# Altium schematic sheet SBH_Charger_Main.SchDoc: SBH_Charger_Main
size C; Date: 01/15/2023; Author: Electric Squad; Organization: ORGANIZATION; Address1: ADDRESS 1; Address2: ADDRESS 2; Address3: ADDRESS 3; Address4: ADDRESS 4; Revision: -; SheetNumber: 2; SheetTotal: 5; ENG_APP_DATE: --/--/--; DSN_APP_DATE: --/--/--; CHK_APP_DATE: --/--/--
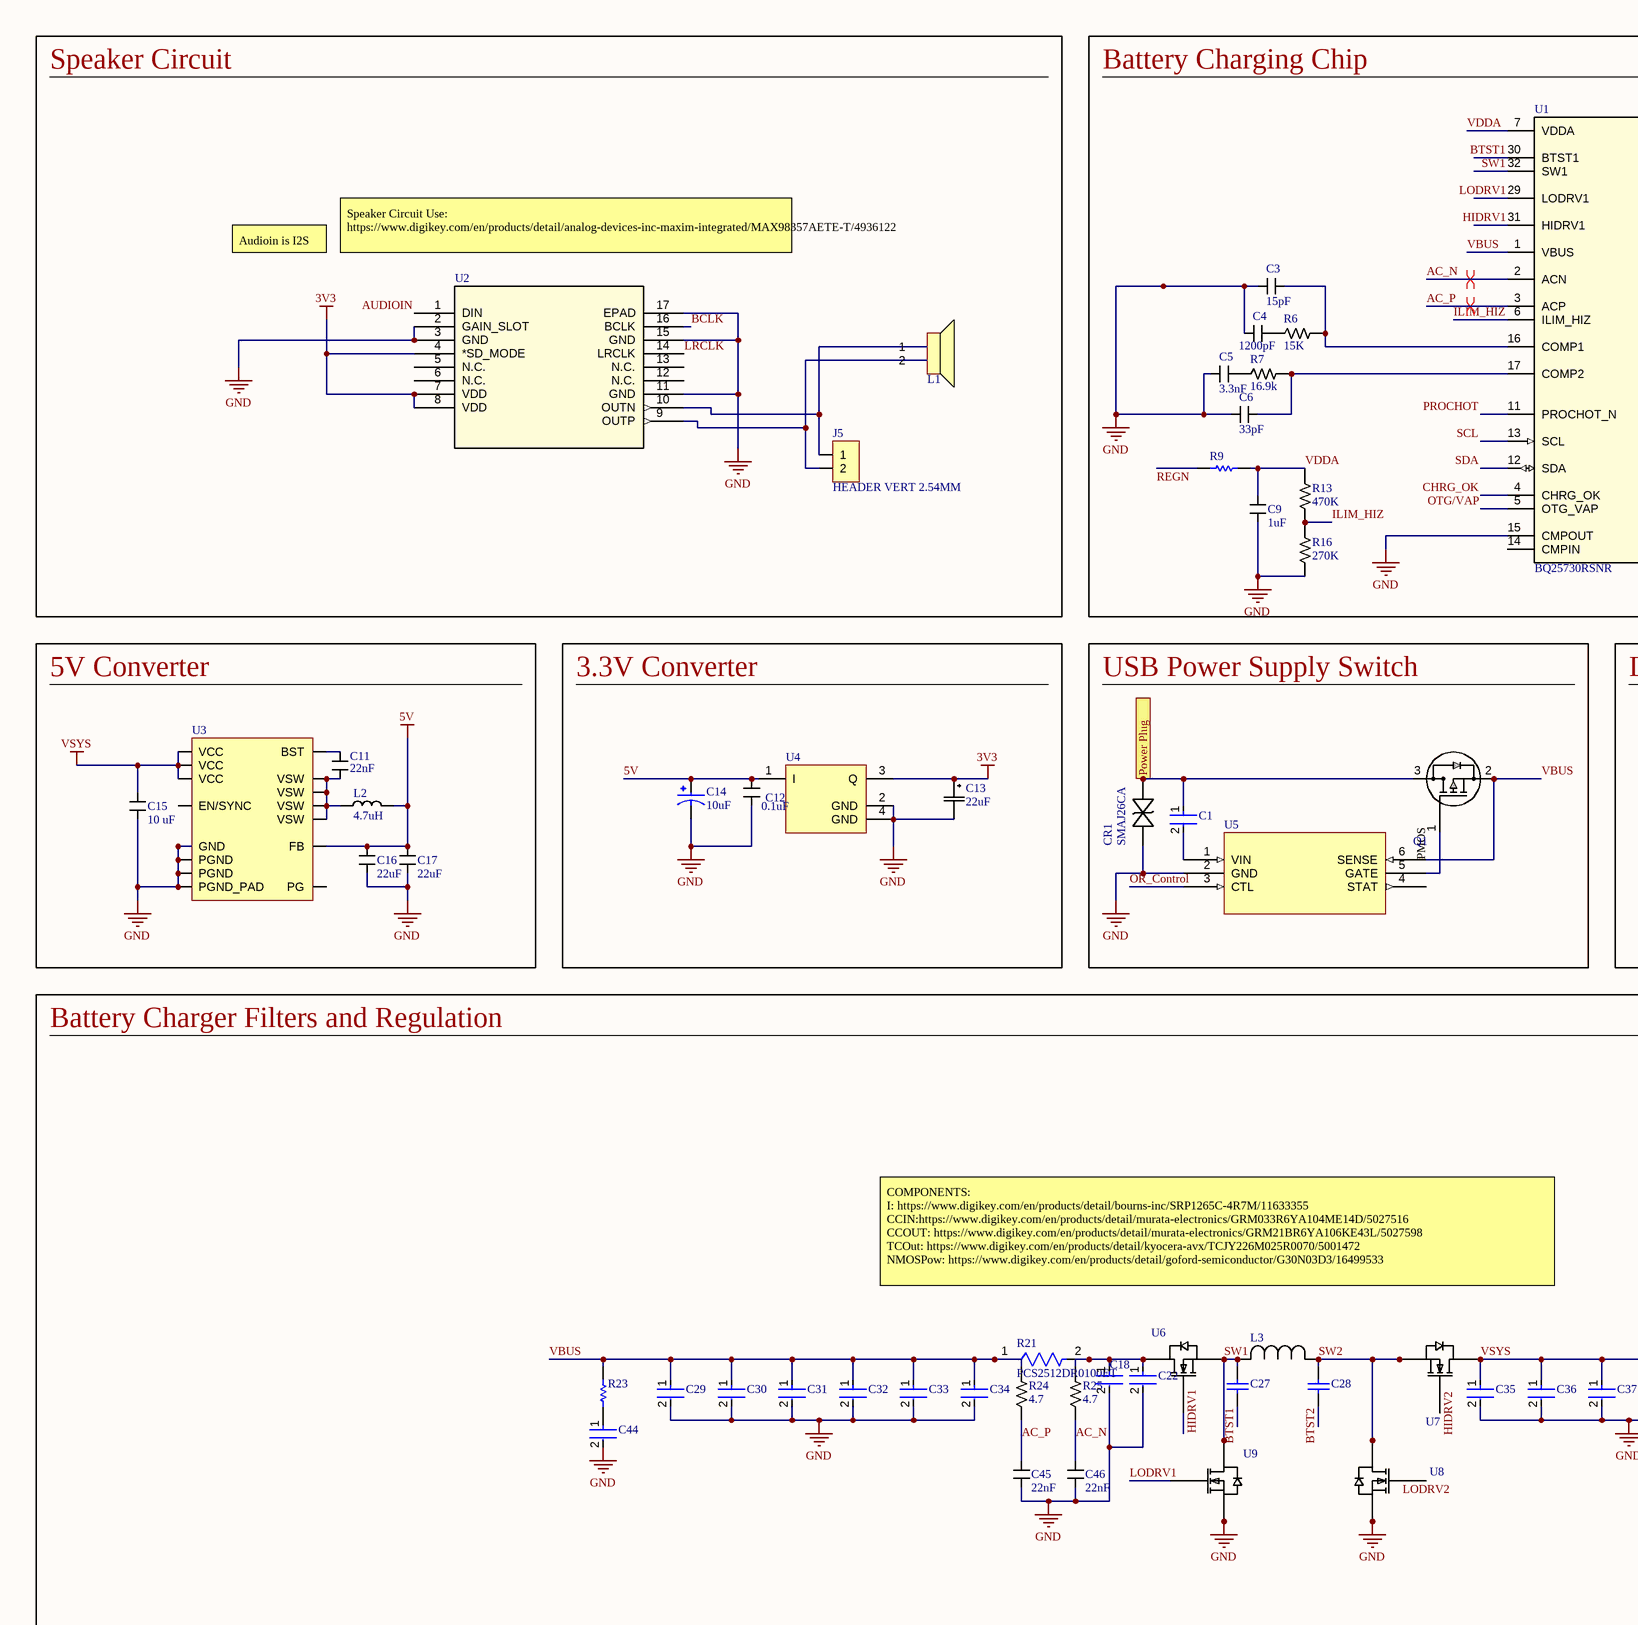
[diagram p0: SBH_Charger_Main.SchDoc, left]
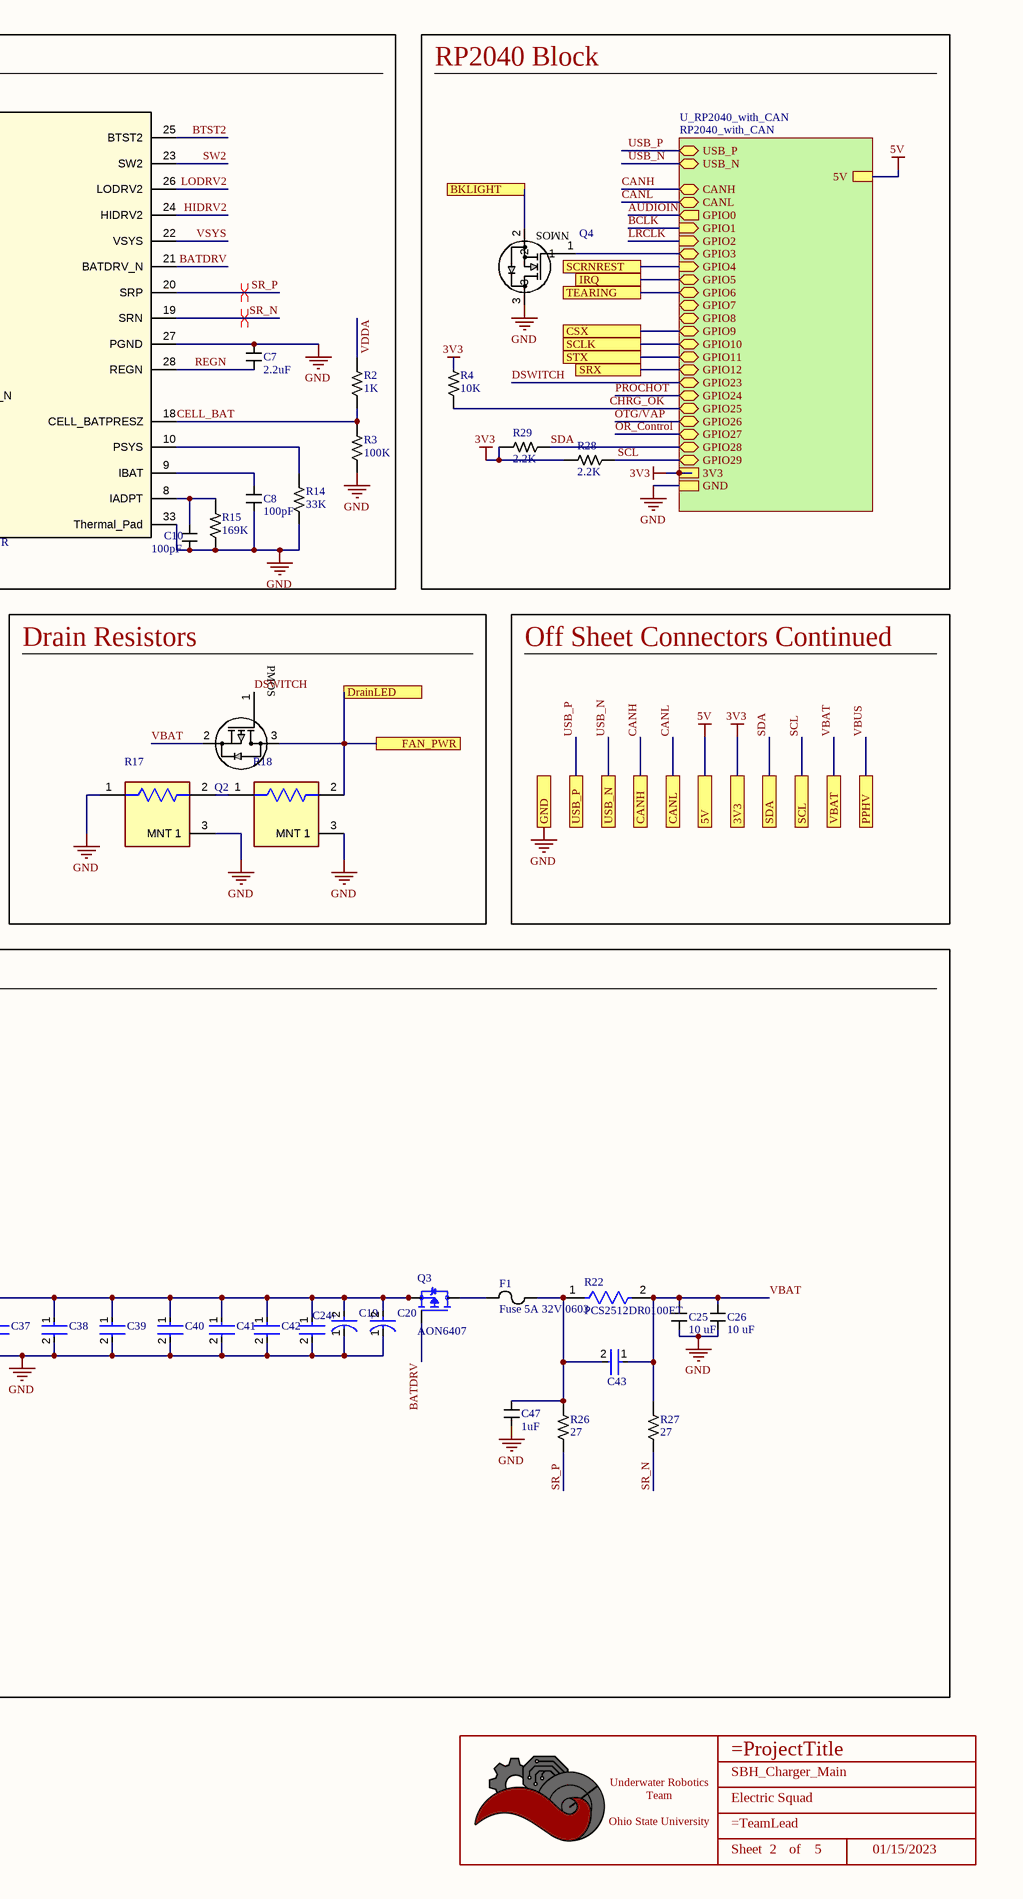
[diagram p1: SBH_Charger_Main.SchDoc, right]

## Parts
*  Title_Block  [LOGO]  (value not drawn)  (graphical)
C1  CC0402KRX7R9BB103  [CAPACITOR_0402]  (value not drawn)
C3  value 15pF  [CAPACITOR_0402]  (hidden comment: 15pF Ceramic 50V)
C4  value 1200pF  [CAPACITOR_0402]  (hidden comment: 1200pF Ceramic 50V)
C5  value 3.3nF  [CAPACITOR_0402]  (hidden comment: 3.3nF Ceramic 50V)
C6  value 33pF  [CAPACITOR_0402]  (hidden comment: 33pF Ceramic 50V)
C7  value 2.2uF  [CAPACITOR_0402]  (hidden comment: 2.2uF Ceramic 35V)
C8  value 100pF  [CAPACITOR_0603]  (hidden comment: 100pF Ceramic 50V)
C9  value 1uF  [CAPACITOR_0603]  (hidden comment: 1uF Ceramic 16V)
C10  value 100pF  [CAPACITOR_0603]  (hidden comment: 100pF Ceramic 50V)
C11  value 22nF  [CAPACITOR_0402]  (hidden comment: 22nF Ceramic 25V)
C12  value 0.1uF  [CAPACITOR_0603]  (hidden comment: 100nF Ceramic 25V)
C13  value 22uF  [PCAP_8x5.4-ELECT_NCA]  (hidden comment: 22uF electrolytic 35 V)
C14  value 10uF  [CAP_EEHZC1J100P]  (hidden comment: 10uF electrolytic 63V)
C15  Value (uF): 10 uF  [CAPACITOR_1206]  (hidden comment: 10uF Ceramic 25V)
C16  value 22uF  [CAPACITOR_0805]  (hidden comment: 22uF Ceramic 10V)
C17  value 22uF  [CAPACITOR_0805]  (hidden comment: 22uF Ceramic 10V)
C18  CC0402KRX7R9BB103  [FP-CC0402-MFG]  (value not drawn)
C19  TAJD226K035RNJ  [FP-TAJD-MFG]  (value not drawn)
C20  TAJD226K035RNJ  [FP-TAJD-MFG]  (value not drawn)
C22  C0402C102J5GACTU  [FP-C0402-BB-MFG]  (value not drawn)
C24  C3216X7R1V106M160AC  [FP-C3216-160-0_2-IPC_C]  (value not drawn)
C25  Value (uF): 10 uF  [CAPACITOR_1206]  (hidden comment: 10uF Ceramic 25V)
C26  Value (uF): 10 uF  [CAPACITOR_1206]  (hidden comment: 10uF Ceramic 25V)
C27  GRM188R71H473KA61D  [CAPC1608X90X35ML10T15]  (value not drawn)
C28  GRM188R71H473KA61D  [CAPC1608X90X35ML10T15]  (value not drawn)
C29  C3216X7R1V106M160AC  [FP-C3216-160-0_2-IPC_C]  (value not drawn)
C30  C3216X7R1V106M160AC  [FP-C3216-160-0_2-IPC_C]  (value not drawn)
C31  C3216X7R1V106M160AC  [FP-C3216-160-0_2-IPC_C]  (value not drawn)
C32  C3216X7R1V106M160AC  [FP-C3216-160-0_2-IPC_C]  (value not drawn)
C33  C3216X7R1V106M160AC  [FP-C3216-160-0_2-IPC_C]  (value not drawn)
C34  C3216X7R1V106M160AC  [FP-C3216-160-0_2-IPC_C]  (value not drawn)
C35  C3216X7R1V106M160AC  [FP-C3216-160-0_2-IPC_C]  (value not drawn)
C36  C3216X7R1V106M160AC  [FP-C3216-160-0_2-IPC_C]  (value not drawn)
C37  C3216X7R1V106M160AC  [FP-C3216-160-0_2-IPC_C]  (value not drawn)
C38  C3216X7R1V106M160AC  [FP-C3216-160-0_2-IPC_C]  (value not drawn)
C39  C3216X7R1V106M160AC  [FP-C3216-160-0_2-IPC_C]  (value not drawn)
C40  C3216X7R1V106M160AC  [FP-C3216-160-0_2-IPC_C]  (value not drawn)
C41  C3216X7R1V106M160AC  [FP-C3216-160-0_2-IPC_C]  (value not drawn)
C42  C3216X7R1V106M160AC  [FP-C3216-160-0_2-IPC_C]  (value not drawn)
C43  GRM033R6YA104ME14D  [FP-GRM033-0_03-IPC_C]  (value not drawn)
C44  UMK107AB7105KA-T  [FP-0603-L_1_6_0_15-W_0_8-IPC_C]  (value not drawn)
C45  value 22nF  [CAPACITOR_0402]  (hidden comment: 22nF Ceramic 25V)
C46  value 22nF  [CAPACITOR_0402]  (hidden comment: 22nF Ceramic 25V)
C47  value 1uF  [CAPACITOR_0603]  (hidden comment: 1uF Ceramic 16V)
CR1  SMAJ26CA  [SMASeries_LTF]
F1  Fuse 5A 32V 0603  [2-SMD Fuse 0603]
J5  HEADER VERT 2.54MM  [HEADER_2PIN_2.54MM]
L1  SPEAKER_SP_1609S  [SPEAKER_SP-1609S]  (value not drawn)
L2  value 4.7uH  [INDUCTOR_SLF7045]  (hidden comment: 4.7uH Shielded Drum Core)
L3  SRP1770TA-3R3M  [INDUCTOR_SRP1770TA-3R3M_BRN]  (value not drawn)
Q1  DMP3056L-7  [SOT-23-3]  (value not drawn)
Q2  DMP3056L-7  [SOT-23-3]  (value not drawn)
Q3  AON6407  [TRANS_AON6407]
Q4  MOSFET N-CH 30V 5.8A SOT-23-3  [SOT-23-3]  (value not drawn)
R2  Value  (Ohms): 1K  [RESISTOR_0603]  (hidden comment: 1k Ohm 5% 1/8W)
R3  Value  (Ohms): 100K  [RESISTOR_0603]  (hidden comment: 100k Ohm 5% 1/8W)
R4  Value  (Ohms): 10K  [RESISTOR_0603]  (hidden comment: 10k Ohm 5% 1/10W)
R6  Value  (Ohms): 15K  [RESISTOR_0603]  (hidden comment: 15k Ohm 5% 1/10W)
R7  Value  (Ohms): 16.9k  [RESISTOR_0402]  (hidden comment: 16.9k Ohm 1% 1/16W)
R9  CRCW040210R0FKEDHP  [RESC1005X40X25NL05T10]  (value not drawn)
R13  Value  (Ohms): 470K  [RESISTOR_0603]  (hidden comment: 470k Ohm 5% 1/10W)
R14  Value  (Ohms): 33K  [RESISTOR_0805]  (hidden comment: 33k Ohm 5% 1/8W)
R15  Value  (Ohms): 169K  [RESISTOR_0603]  (hidden comment: 169K OHM 1% 1/3W)
R16  Value  (Ohms): 270K  [RESISTOR_0603]  (hidden comment: 270k Ohm 1% 1/10W)
R17  PWR163S-25-10R0JE  [FP-PWR163-MFG]  (value not drawn)
R18  PWR163S-25-10R0JE  [FP-PWR163-MFG]  (value not drawn)
R21  PCS2512DR0100ET  [FP-PCS2512-MFG]
R22  PCS2512DR0100ET  [FP-PCS2512-MFG]
R23  CRCW06032R20FKEA  [RESC1609X50X30ML10T20]  (value not drawn)
R24  Value  (Ohms): 4.7  [RESISTOR_0603]  (hidden comment: 4.7 Ohm 5% 1/8W)
R25  Value  (Ohms): 4.7  [RESISTOR_0603]  (hidden comment: 4.7 Ohm 5% 1/8W)
R26  Value  (Ohms): 27  [RESISTOR_0603]  (hidden comment: 27 Ohm 5% 1/8W)
R27  Value  (Ohms): 27  [RESISTOR_0603]  (hidden comment: 27 Ohm 5% 1/8W)
R28  Value  (Ohms): 2.2K  [RESISTOR_0402]  (hidden comment: 2.2k Ohm 1% 1/16W)
R29  Value  (Ohms): 2.2K  [RESISTOR_0402]  (hidden comment: 2.2k Ohm 1% 1/16W)
U1  BQ25730RSNR  [RSN0032B-IPC_B]
U2  MAX98357AETE+T  [TQFN-16]  (value not drawn)
U3  REG BUCK 5V 1A  [QFN-16 (3x3)]  (value not drawn)
U4  TLE42744GS V33  [INF-PG-SOT223_SC-73_N]  (value not drawn)
U5  LTC4412ES6TRPBF  [TSOT-23_S6]  (value not drawn)
U6  G30N03D3  [DNH0008A_NV]  (value not drawn)
U7  G30N03D3  [DNH0008A_NV]  (value not drawn)
U8  G30N03D3  [DNH0008A_NV]  (value not drawn)
U9  G30N03D3  [DNH0008A_NV]  (value not drawn)

## Blocks framed on the sheet
Speaker Circuit: J5 L1 U2
Battery Charging Chip: C3-C10 R2 R3 R6 R7 R9 R13-R16 U1
RP2040 Block: Q4 R4 R28 R29
5V Converter: C11 C15-C17 L2 U3
3.3V Converter: C12-C14 U4
USB Power Supply Switch: C1 CR1 Q1 U5
Drain Resistors: Q2 R17 R18
Battery Charger Filters and Regulation: C18-C20 C22 C24-C47 F1 L3 Q3 R21-R27 U6-U9

## Sub-sheets
U_RP2040_with_CAN = RP2040_with_CAN: USB_P (bidir), USB_N (bidir), 5V, CANH (bidir), CANL (bidir), GPIO0 (out), GPIO1 (in), GPIO2 (in), GPIO3 (bidir), GPIO4 (in), GPIO5 (bidir), GPIO6 (bidir), GPIO7 (bidir), GPIO8 (bidir), GPIO9 (bidir), GPIO10 (bidir), GPIO11 (bidir), GPIO12 (bidir), GPIO23 (bidir), GPIO24 (bidir), GPIO25 (bidir), GPIO26 (bidir), GPIO27 (bidir), GPIO28 (bidir), GPIO29 (bidir), 3V3, GND

## Ports
3V3, 5V, BKLIGHT, CANH, CANL, CSX, DrainLED, FAN_PWR, GND, IRQ, Power Plug, PPHV, SCL, SCLK, SCRNREST, SDA, SRX, STX, TEARING, USB_N, USB_P, VBAT

## Nets
3V3: C13.1 R4.1 R28.1 R29.1 U2.4(*SD_MODE) U2.7(VDD) U2.8(VDD) U4.3(Q) ; port 3V3, sheet U_RP2040_with_CAN/3V3
5V: C12.1 C14.1 C16.1 C17.1 L2.1 U3.5(FB) U4.1(I) ; port 5V, sheet U_RP2040_with_CAN/5V
GND: C3.2 C4.2 C5.2 C6.2 C7.1 C8.2 C9.2 C10.2 C12.2 C13.2 C14.2 C15.2 C16.2 C17.2 C18.2 C19.1(C) C20.1(C) C22.2 C24.2 C25.2 C26.2 C29.2 C30.2 C31.2 C32.2 C33.2 C34.2 C35.2 C36.2 C37.2 C38.2 C39.2 C40.2 C41.2 C42.2 C44.2 C45.2 C46.2 C47.1 CR1.2 Q4.3 R3.2 R14.2 R15.2 R16.2 R17.1 R17.3(MNT_1) R18.3(MNT_1) U1.15(CMPOUT) U1.27(PGND) U1.33(Thermal_Pad) U2.2(GAIN_SLOT) U2.3(GND) U2.11(GND) U2.15(GND) U2.17(EPAD) U3.4(GND) U3.14(PGND) U3.15(PGND) U3.17(PGND_PAD) U4.2(GND) U4.4(GND) U5.2(GND) U8.1(S) U8.2(S) U8.3(S) U9.1(S) U9.2(S) U9.3(S) ; port GND, sheet U_RP2040_with_CAN/GND
VSYS: C15.1 C19.2(A) C20.2(A) C24.1 C35.1 C36.1 C37.1 C38.1 C39.1 C40.1 C41.1 C42.1 Q3.1(S) Q3.2(S) Q3.3(S) U1.22(VSYS) U3.2(VCC) U3.3(VCC) U3.11(VCC) U7.5(D) U7.6(D) U7.7(D) U7.8(D) U7.9(D)
AC_N: C46.1 R25.2 U1.2(ACN)
AC_P: C45.1 R24.2 U1.3(ACP)
AUDIOIN: U2.1(DIN) ; sheet U_RP2040_with_CAN/GPIO0
BATDRV: Q3.4(G) U1.21(BATDRV_N)
BCLK: U2.16(BCLK) ; sheet U_RP2040_with_CAN/GPIO1
BKLIGHT: Q4.2 ; port BKLIGHT
BTST1: C27.1 U1.30(BTST1)
BTST2: C28.1 U1.25(BTST2)
CANH: port CANH, sheet U_RP2040_with_CAN/CANH
CANL: port CANL, sheet U_RP2040_with_CAN/CANL
CELL_BAT: R2.2 R3.1 U1.18(CELL_BATPRESZ)
CHRG_OK: R4.2 U1.4(CHRG_OK) ; sheet U_RP2040_with_CAN/GPIO25
CSX: port CSX, sheet U_RP2040_with_CAN/GPIO9
DrainLED: Q2.3 R18.2 ; port FAN_PWR, port DrainLED
DSWITCH: Q2.1 ; sheet U_RP2040_with_CAN/GPIO23
HIDRV1: U1.31(HIDRV1) U6.4(G)
HIDRV2: U1.24(HIDRV2) U7.4(G)
ILIM_HIZ: R13.2 R16.1 U1.6(ILIM_HIZ)
IRQ: port IRQ, sheet U_RP2040_with_CAN/GPIO5
LODRV1: U1.29(LODRV1) U9.4(G)
LODRV2: U1.26(LODRV2) U8.4(G)
LRCLK: U2.14(LRCLK) ; sheet U_RP2040_with_CAN/GPIO2
OR_Control: U5.3(CTL) ; sheet U_RP2040_with_CAN/GPIO27
OTG/VAP: U1.5(OTG_VAP) ; sheet U_RP2040_with_CAN/GPIO26
Power Plug: C1.1 CR1.1 Q1.3 ; port Power Plug
PROCHOT: U1.11(PROCHOT_N) ; sheet U_RP2040_with_CAN/GPIO24
REGN: C7.2 R9.1 U1.28(REGN)
SCL: R28.2 U1.13(SCL) ; port SCL, sheet U_RP2040_with_CAN/GPIO29
SCLK: port SCLK, sheet U_RP2040_with_CAN/GPIO10
SCRNREST: port SCRNREST, sheet U_RP2040_with_CAN/GPIO4
SDA: R29.2 U1.12(SDA) ; port SDA, sheet U_RP2040_with_CAN/GPIO28
SR_N: R27.2 U1.19(SRN)
SR_P: R26.2 U1.20(SRP)
SRX: port SRX, sheet U_RP2040_with_CAN/GPIO12
STX: port STX, sheet U_RP2040_with_CAN/GPIO11
SW1: C27.2 L3.2 U1.32(SW1) U6.1(S) U6.2(S) U6.3(S) U9.5(D) U9.6(D) U9.7(D) U9.8(D) U9.9(D)
SW2: C28.2 L3.1 U1.23(SW2) U7.1(S) U7.2(S) U7.3(S) U8.5(D) U8.6(D) U8.7(D) U8.8(D) U8.9(D)
TEARING: port TEARING, sheet U_RP2040_with_CAN/GPIO6
USB_N: port USB_N, sheet U_RP2040_with_CAN/USB_N
USB_P: port USB_P, sheet U_RP2040_with_CAN/USB_P
VBAT: C25.1 C26.1 C43.1 Q2.2 R22.2 R27.1 ; port VBAT
VBUS: C29.1 C30.1 C31.1 C32.1 C33.1 C34.1 Q1.2 R21.1 R23.2 R24.1 U1.1(VBUS) U5.6(SENSE) ; port PPHV
VDDA: C9.1 R2.1 R9.2 R13.1 U1.7(VDDA)
NetC1_2: C1.2 U5.1(VIN)
NetC3_1: C3.1 R6.1 U1.16(COMP1)
NetC4_1: C4.1 R6.2
NetC5_1: C5.1 R7.2
NetC6_1: C6.1 R7.1 U1.17(COMP2)
NetC8_1: C8.1 U1.9(IBAT)
NetC10_1: C10.1 R15.1 U1.8(IADPT)
NetC11_1: C11.1 U3.10(BST)
NetC11_2: C11.2 L2.2 U3.1(VSW) U3.12(VSW) U3.13(VSW) U3.16(VSW)
NetC18_1: C18.1 C22.1 R21.2 R25.1 U6.5(D) U6.6(D) U6.7(D) U6.8(D) U6.9(D)
NetC43_2: C43.2 C47.2 F1.2 R22.1 R26.1
NetC44_1: C44.1 R23.1
NetF1_1: F1.1 Q3.5_8(D)
NetJ5_1: J5.1 L1.1 U2.10(OUTN)
NetJ5_2: J5.2 L1.2 U2.9(OUTP)
NetQ1_1: Q1.1 U5.5(GATE)
NetQ4_1: Q4.1 ; sheet U_RP2040_with_CAN/GPIO3
NetR14_1: R14.1 U1.10(PSYS)
NetR17_2: R17.2 R18.1

Not connected (* = marked no-connect by the designer): U1 14(CMPIN); U2 5(N.C.) 6(N.C.) 12(N.C.) 13(N.C.); U3 8(PG) 9(EN/SYNC); U5 4(STAT)

## Layout directives
differential pair: AC_N, AC_P, SR_N, SR_P

## Notes on the sheet
- Audioin is I2S
- Speaker Circuit Use: https://www.digikey.com/en/products/detail/analog-devices-inc-maxim-integrated/MAX98357AETE-T/4936122
- Off Sheet Connectors Continued
- COMPONENTS:
  I: https://www.digikey.com/en/products/detail/bourns-inc/SRP1265C-4R7M/11633355
  CCIN:https://www.digikey.com/en/products/detail/murata-electronics/GRM033R6YA104ME14D/5027516
  CCOUT: https://www.digikey.com/en/products/detail/murata-electronics/GRM21BR6YA106KE43L/5027598
  TCOut: https://www.digikey.com/en/products/detail/kyocera-avx/TCJY226M025R0070/5001472
  NMOSPow: https://www.digikey.com/en/products/detail/goford-semiconductor/G30N03D3/16499533
- DWG. NO.
- REV.
- SHT.
- THIS DOCUMENT AND THE DATA DISCLOSED HEREIN OR HEREWITH IS THE PROPERTY OF ALTIUM LIMITED AND MAY BE FREELY DISTRIBUTED IN WHOLE. NO RIGHTS ARE RESERVED OR EXPRESS OR IMPLIED WARANTEE GIVEN.
- REVISION
- DESCRIPTION
- DATE
- APPROVED
- ENG:
- APPROVALS
- PROJECT
- DSN:
- CHK:
- REFERENCE DOCUMENTS
- PROJECT REVISION:
- TITLE
- DOCUMENT REVISION:
- DESIGN ITEM:
- BOM:
- FAB DWG:
- PCB DWG:
- ASSY DWG:
- SCALE:
- SIZE
- B
- CAGE CODE
- FILE NAME
- DWG NO.
- SHEET
- OF
- REV
- (in symbol AO3404A) NMOS
- (in symbol CMP-04424-000506-1) +
- (in symbol DMP3056L-7) PMOS
- (in symbol Title_Block) Underwater Robotics Team / Ohio State University; Sheet; of

## Library data of the parts
* = Title_Block: UWRT Schematic Title Block Template / Created June 2021, Dylan Trainor
C1 = CAP CER 0.01 UF 0402: CAP CER 10000PF 50V X7R 0402; Manufacturer: YAGEO; Temperature Coefficient: 30ppm/°C; Capacitance: 10 nF; Material: Ceramic; Automotive Grade: NA; Tolerance: 0.1; Value: 10 nF; Device Class L3: Ceramic Capacitors; Temperature: -55°C to +125°C; Footprint Url: http://www.yageo.com/exep/pages/download/literatures/UPY-C_GEN_24.pdf; Ipc Land Pattern Name: CAPC10050X50; Device Class L1: Passive Components; Automotive: No; Octopart: https://octopart.com/cc0402krx7r9bb103-yageo-8376513; Manufacturer Part Number: CC0402KRX7R9BB103; Lead Free: Yes; Temperature Range Low: -55°C; Height: 0.55mm; ComponentLink2URL: http://www.yageo.com/documents/recent/UPY-GP_NP0_16V-to-50V_16.pdf; Category: Cap; ComponentLink2Description: Datasheet; Temperature Range High: +125°C; Digikey Description: CAP CER 10000PF 50V X7R 0402; Voltage Rating: 50 V; Package: CC0402; Device Class L2: Capacitors; Mouser Description: 0402 10 nF 50 V ±10 % Tolerance X7R SMT Multilayer Ceramic Capacitor; RoHS: TRUE; Temperature Characteristic: X7R; Supplier 1: Future Electronics; Supplier Part Number 1: 8570871
C3 = CAPACITOR_0.000015uF_0402: CAP CER 15PF 50V C0G/NP0 0402; Tolerance: +/- 5%; Made By: Robert Pafford; Voltage: 50V; Supplier 1: Newark; Supplier Part Number 1: 82AC9245
C4 = CAPACITOR_0.0012uF_0402: CAP CER 1200PF 50V X7R 0402; Tolerance: +/- 5%; Made By: Robert Pafford; Voltage: 50V; Supplier 1: Future Electronics; Supplier Part Number 1: 5334081
C5 = CAPACITOR_0.0033uF_0402: CAP CER 3300PF 50V X7R 0402; Tolerance: +/- 5%; Made By: Robert Pafford; Voltage: 50V; Supplier 1: Arrow Electronics; Supplier Part Number 1: CL05B332KB5NNNC
C6 = CAPACITOR_0.000033uF_0402: CAP CER 33PF 50V C0G/NP0 0402; Tolerance: +/- 5%; Made By: Robert Pafford; Voltage: 50V; Supplier 1: Newark; Supplier Part Number 1: 82AC9259
C7 = CAPACITOR_2.2uF_0402: Cap 2.2uF 35V +/-10% / Ceramic 0402; Made By: Flip B; Tolerance: +/- 10%; Voltage: 35V; Supplier 1: Digi-Key; Supplier Part Number 1: 445-9028-1-ND
C8 C10 = CAPACITOR_0.0001uF_0603: CAP CER 100PF 50V C0G/NP0 0603; Tolerance: +/- 5%; Made By: Robert Pafford; Voltage: 50V; Supplier 1: Arrow Electronics; Supplier Part Number 1: CL10C101JB8NNNC
C9 C47 = CAPACITOR_1uF_0603: Cap 1uF 16V +/-10% / Ceramic 0603; Made By: Flip B; Tolerance: +/- 10%; Voltage: 16V; Supplier 1: Arrow Electronics; Supplier Part Number 1: C1608X7R1C105K080AC
C11 C45 C46 = CAPACITOR_0.022uF_0402: Cap 22nF 25V +/-10% / Ceramic 0402; Made By: Robert Pafford; Tolerance: +/- 10%; Voltage: 25V; Supplier 1: Digi-Key; Supplier Part Number 1: 445-1261-1-ND
C12 = CAPACITOR_0.1uF_0603_25V: Cap 100nF 25V +/-10% / Ceramic 0603; Voltage: 6.3V; Made By: Flip B; ComponentLink1Description: Datsheet; ComponentLink1URL: https://www.mouser.com/datasheet/2/212/KEM_C1002_X7R_SMD-1102033.pdf; Tolerance: +/- 10%; Supplier 1: Digikey; Supplier Part Number 1: 1276-1006-1-ND
C13 = CAP ALUM 22UF 20% 35V SMD: 22 µF 35 V Aluminum Electrolytic Capacitors Radial, Can - SMD 1000 Hrs; Made by: Robert Pafford; Voltage: 35V; Supplier 1: Digi-Key; Supplier Part Number 1: PCE3952DKR-ND
C14 = CAP ALUM 10UF 20% 63V SMD: 10 µF 63 V Aluminum - Polymer Capacitors Radial, Can SMD 120mOhm; Made by: Robert Pafford; Tolerance: +/- 20%; Max Voltage: 63V; Supplier 1: Digi-Key; Supplier Part Number 1: P15466CT-ND
C15 C25 C26 = CAPACITOR_10uF_1206: Cap 10uF 25V +/-10% / Ceramic 1206; Made By: Robert Pafford; Tolerance: +/- 10%; Voltage: 25V; Supplier 1: Digi-Key; Supplier Part Number 1: 1276-1804-6-ND
C16 C17 = CAPACITOR_22uF_0805: Cap 22uF 10V +/-20% X5R / Ceramic 0805; Made By: Robert Pafford; Tolerance: +/- 20%; Voltage: 10V; Supplier 1: Digi-Key; Supplier Part Number 1: 445-7665-6-ND
C18 = CMP-2100-03592-2: CAP CER 10000PF 50V X7R 0402; Manufacturer: YAGEO; Temperature Coefficient: 30ppm/°C; Capacitance: 10 nF; Material: Ceramic; Automotive Grade: NA; Tolerance: 0.1; Value: 10 nF; Device Class L3: Ceramic Capacitors; Temperature: -55°C to +125°C; Footprint Url: http://www.yageo.com/exep/pages/download/literatures/UPY-C_GEN_24.pdf; Ipc Land Pattern Name: CAPC10050X50; Device Class L1: Passive Components; Automotive: No; Octopart: https://octopart.com/cc0402krx7r9bb103-yageo-8376513; Manufacturer Part Number: CC0402KRX7R9BB103; Lead Free: Yes; Temperature Range Low: -55°C; Height: 0.55mm; ComponentLink2URL: http://www.yageo.com/documents/recent/UPY-GP_NP0_16V-to-50V_16.pdf; Category: Cap; ComponentLink2Description: Datasheet; Temperature Range High: +125°C; Digikey Description: CAP CER 10000PF 50V X7R 0402; Voltage Rating: 50 V; Package: CC0402; Device Class L2: Capacitors; Mouser Description: 0402 10 nF 50 V ±10 % Tolerance X7R SMT Multilayer Ceramic Capacitor; RoHS: TRUE; Temperature Characteristic: X7R
C19 C20 = CMP-04424-000506-1: 22uF 35V  ±10% 900mΩ 2917  SMD Tantalum Capacitor; ESR (Equivalent Series Resistance): 900mR; Dissipation Factor: 6%; Polarity: Polar; Leakage Current: 7.7uA; Min Operating Temperature: -55°C; Dielectric Material: Tantalum; Radiation Hardening: No; Height: 2.9mm; Voltage Rating: 35V; Features: General Purpose; Package Quantity: 1; Capacitance: 22uF; Tolerance: 10%; Series: TAJ; Height - Seated (Max): 0.122inch; Mount: Surface Mount; Termination: SMD/SMT; Length: 7.3mm; Construction: Flat; Width: 4.3mm; Case Code (Metric): 7343; Voltage: 35V; Depth: 4.3mm; Packaging: Tape and Reel; Max Operating Temperature: 125°C; RoHS Compliant: Yes; Case/Package: 2917; Lead Free: Lead Free; Case Code (Imperial): 2917; Number of Pins: 2; REACH SVHC: No SVHC; Voltage Rating (DC): 35V
C22 = CMP-2008-03295-2: CAP CER 1000PF 50V 5% NP0 0402; Manufacturer: Kemet; Material: Ceramic; Temperature Characteristic: C0G; Temperature Coefficient: 15%; Capacitance: 1,000 pF; Tolerance: 0.05; Value: 1,000 pF; Manufacturer Part Number: C0402C102J5GACTU; ComponentLink2Description: Datasheet; Octopart: https://octopart.com/c0402c102j5gactu-kemet-9145103; Package: C0402-BB; Ipc Land Pattern Name: CAPC10050X50; Automotive: No; Mouser Description: Cap Ceramic 0.001uF 50V C0G 5% SMD 0402 125°C Paper T/R; Digikey Description: CAP CER 1000PF 50V 5% NP0 0402; Temperature Range High: +125°C; Temperature Range Low: -55°C; Device Class L3: Ceramic Capacitors; Temperature: -55°C to +125°C; Device Class L1: Passive Components; Category: Cap; Voltage Rating: 50 V; Device Class L2: Capacitors; ComponentLink2URL: https://content.kemet.com/datasheets/KEM_C1002_X7R_SMD.pdf; Height: 0.55mm; RoHS: TRUE; Lead Free: Yes
C24 C29-C42 = CMP-2000-06048-2: Multilayer Ceramic Capacitors 10uF ±20% 35V X7R SMD 1206; RoHS Compliant: Yes; Voltage Rating (DC): 35V; Termination: SMD/SMT; Thickness: 0.071inch; Max Operating Temperature: 125°C; Length: 3.2mm; Width: 0.063inch; Tolerance: 20%; Case Code (Metric): 3216; Capacitance: 10uF; REACH SVHC: No SVHC; Case/Package: 1206; Dielectric: X7R; Series: C; Min Operating Temperature: -55°C; Resistor Type: Ceramic; Weight: 0.000571oz; Voltage Rating: 35V; Mount: Surface Mount; Package Quantity: 2000; Case Code (Imperial): 1206; Depth: 1.6mm; Packaging: Tape and Reel; Dielectric Material: Ceramic; Lead Free: Lead Free; Height: 1.6mm; Construction: Flat
C27 C28 = CMP-2006-02927-1: Manufacturer: Murata; Part Number: GRM188R71H473KA61D
C43 = CAPACITOR_0.1uF_0603_1: Chip Multilayer Ceramic Capacitors for General Purpose, 0201, 0.10uF, X5R, 15%, 20%, 35V; Capacitance: 100nF; Tolerance: 20%; Supplier 1: Arrow Electronics; Supplier Part Number 1: GRM033R6YA104ME14D; Case/Package: 0201; Mount: Surface Mount; Voltage Rating (DC): 35V; Weight: 1.2E-05oz; Case Code (Metric): 0603; Min Operating Temperature: -55°C; Thickness: 0.013inch; Case Code (Imperial): 0201; Dielectric: X5R; Termination: SMD/SMT; Length: 0.024inch; Height: 0.3mm; Package Quantity: 15000; Width: 0.012inch; Voltage Rating: 35V; Max Operating Temperature: 85°C; Packaging: Tape and Reel
C44 = CMP-2000-07531-4: Ceramic Capacitor General Use 1uF ±10% 50V X7R 0603; Series: M; Width: 0.031inch; Mount: Surface Mount; Radiation Hardening: No; Voltage Rating (DC): 50V; Packaging: Tape and Reel; Termination: SMD/SMT; Depth: 0.8mm; Case Code (Metric): 1608; Case Code (Imperial): 0603; Height: 0.8mm; Voltage Rating: 50V; Package Quantity: 1; Halogen Free: Halogen Free; Dielectric: X7R; Min Operating Temperature: -55°C; Length: 1.6mm; Construction: Flat; Tolerance: 10%; Thickness: 0.037inch; Max Operating Temperature: 125°C; Case/Package: 0603; Capacitance: 1uF; RoHS Compliant: Yes
CR1 = TVS_SMAJ26CA: TVS DIODE 26VWM 42.1VC DO214AC; Mfr_Name: Littelfuse Inc; Type: DEV; Copyright: Copyright (C) 2024 Ultra Librarian. All rights reserved.; Manufacturer_Part_Number: SMAJ26CA; RefDes: RefDes
F1 = ERB-RE5R00V: Pansonic | 32V | 5A | 0603 | Fast Blow; Mfr_Name: Panasonic; Breaking Capacity: 150A; Manufacturer_Part_Number: ERB-RE5R00V; Current Rating: 5A; Voltage Rating: 32V; Response Time: Fast Blow; Package: 1206; Created By: Robert Pafford; Supplier 1: Digi-Key; Supplier Part Number 1: P15125CT-ND
J5 = HEADER_2PIN_2.54MM: CONN HEADER VERT 2POS 2.54MM; Configuration: Vertical; Current Per Pin: 1A; Number of Positions: 2; Manufacturer: *; Pitch: 2.54mm; Color: Natural; Created By: Robert P; ComponentLink1Description: Datasheet; ComponentLink1URL: https://www.molex.com/pdm_docs/sd/026013115_sd.pdf; Series: *; Supplier 1: Digi-Key; Supplier Part Number 1: A121480-ND; Supplier 2: Mouser; Supplier Part Number 2: 571-5-146280-2
L1 = SPEAKER_SP_1609S: 8 Ohms General Purpose Speaker 700 mW 200 Hz ~ 5 kHz Top Rectangular; Supplier 1: Digi-Key; Supplier Part Number 1: 433-1132-ND
L2 = INDUCTOR_4.7uH_SLF7045T: 4.7 µH Shielded Drum Core, Wirewound Inductor 2.1 A 36mOhm Max Nonstandard; Tolerance: +/- 20%; Made By: Robert Pafford; Current Rating: 2.1A; DC Resistance: 36mOhm; Supplier 1: Digi-Key; Supplier Part Number 1: 587-2617-1-ND
L3 = INDUCTOR_3.3uH_SRP1770TA_3R3M: 3.3 µH Shielded Drum Core, Wirewound Inductor 28 A 3.9mOhm Max Nonstandard; Mfr_Name: Bourns Electronics; Manufacturer_Part_Number: SRP1265C-4R7M; Type: DEV; Copyright: Copyright (C) 2023 Ultra Librarian. All rights reserved.; RefDes: RefDes; Supplier 1: Newark; Supplier Part Number 1: 58Y3764
Q1 Q2 = DMP3056L-7: P-Channel 30V 4.3A (Ta) 1.38W (Ta) Surface Mount SOT23; Reviewed By: ---; VDSS (Max): -30V; Vgss (Max): +-25V; Id: -4.3A; Created By: John Ulm; Supplier 1: Digi-Key; Supplier Part Number 1: DMP3056L-7DICT-ND
Q3 = AON6407: P-Channel 30V 32A (Ta), 85A (Tc) 7.3W (Ta), 83W (Tc) Surface Mount 8-DFN (5x6); MF: Alpha &; SnapEDA_Link: https://www.snapeda.com/parts/AON6407/Alpha%20&%20Omega%20Semiconductor%20Inc./view-part/2658357/?ref=snap; MP: AON6407; Value: *; Digi-Key_Part_Number: 785-1421-1-ND; Check_prices: https://www.snapeda.com/parts/AON6407/Alpha%20&%20Omega%20Semiconductor%20Inc./view-part/2658357/?ref=eda; Package: DFN-8 Alpha &amp; Omega Semiconductor
Q4 = AO3404A: N-Channel 30 V 5.8A (Ta) 1.4W (Ta) Surface Mount SOT-23-3; Vendor: Alpha & Omega Semiconductor Inc.; SourceLibrary: ON_Semiconductor_2020-01-13; Vgs (Max): 3V @ 5.8A, 10V; Vgs (th): 3V @ 250µA; Rds (on): 28mOhm @ 5.8A, 10V; Amp Rating: 5.8 A; FET Type: N-Channel; Package: SOT23-3L; Manufacturer _Part_Number: AO3404A; Vdss: 30V; Power Dissipation: 1.4W (Ta); Supplier 1: Digi-Key; Supplier Part Number 1: 785-1004-1-ND; Created By: Dylan T
R2 = RESISTOR_1K_0603: RES 1k OHM 5% 1/8W 0603; Tolerance: +/- 5%; Made By: Robert Pafford; ComponentLink1Description: Datasheet; ComponentLink1URL: https://www.bourns.com/docs/product-datasheets/CRxxxxx.pdf; Wattage: 1/8W; Supplier: Digikey; Digikey Part Numer: CR0603-JW-104ELFTR-ND; Supplier 1: Digi-Key; Supplier Part Number 1: 2019-RK73B1JTTD102JCT-ND
R3 = RESISTOR_100K_0603: RES 100k OHM 5% 1/10W 0603; Tolerance: +/- 5%; Made By: Flip B; ComponentLink1Description: Datasheet; ComponentLink1URL: https://www.bourns.com/docs/product-datasheets/CRxxxxx.pdf; Wattage: 1/10W; Supplier: Digikey; Digikey Part Numer: CR0603-JW-104ELFTR-ND; Supplier 1: Digi-Key; Supplier Part Number 1: CR0603-JW-104ELFCT-ND
R4 = RESISTOR_10K_0603: RES 10k OHM 5% 1/10W 0603; Tolerance: +/- 5%; Wattage: 1/8W; Made By: Robert Pafford; ComponentLink1Description: Datasheet; ComponentLink1URL: https://www.bourns.com/docs/product-datasheets/CRxxxxx.pdf; Supplier: Digikey; Digikey Part Numer: CR0603-JW-104ELFTR-ND; Supplier 1: Digi-Key; Supplier Part Number 1: 2019-RK73B1JTTD103JCT-ND
R6 = RESISTOR_15K_0603: RES 15k OHM 5% 1/10W 0603; Tolerance: +/- 5%; Wattage: 1/8W; Made By: Dylan Trainor; ComponentLink1Description: Datasheet; ComponentLink1URL: https://www.bourns.com/docs/product-datasheets/CRxxxxx.pdf; Supplier: Digikey; Digikey Part Numer: CR0603-JW-104ELFTR-ND; Supplier 1: Avnet; Supplier Part Number 1: RMCF0603JG15K0
R7 = RESISTOR_16.9K_0402: 16.9 kOhms ±1% 0.063W, 1/16W Chip Resistor 0402 (1005 Metric) Moisture Resistant Thick Film; Tolerance: +/- 1%; Made By: Andrew Lin; Wattage: 1/16W; Supplier 1: Future Electronics; Supplier Part Number 1: 5791231
R9 = CMP-2002-03046-1: Manufacturer: Vishay Dale; Part Number: CRCW040210R0FKEDHP
R13 = RESISTOR_470K_0603: RES 470k OHM 5% 1/10W 0603; Tolerance: +/- 5%; Made By: Robert P; ComponentLink1Description: Datasheet; ComponentLink1URL: https://www.bourns.com/docs/product-datasheets/CRxxxxx.pdf; Wattage: 1/10W; Supplier 1: Digi-Key; Supplier Part Number 1: RMCF0603JT470KCT-ND
R14 = RESISTOR_33K_0805: RES 33k OHM 5% 1/8W 0805; Tolerance: +/- 5%; Made By: Dylan Trainor; ComponentLink1Description: Datasheet; ComponentLink1URL: https://www.bourns.com/docs/product-datasheets/CRxxxxx.pdf; Wattage: 1/8W; Supplier: Digikey; Digikey Part Numer: CR0603-JW-104ELFTR-ND; Supplier 1: Newark; Supplier Part Number 1: 65T8819
R15 = RESISTOR_169K_1%_0603: 169 kOhms ±1% 0.333W, 1/3W Chip Resistor 0603 (1608 Metric) Automotive AEC-Q200, Pulse Withstanding Thick Film; Tolerance: +/- 1%; Wattage: 1/10W; Made By: Andrew Lin; ComponentLink1Description: Datasheet; ComponentLink1URL: https://www.bourns.com/docs/product-datasheets/CRxxxxx.pdf; Supplier: Digikey; Digikey Part Numer: CR0603-JW-104ELFTR-ND; Supplier 1: Digi-Key; Supplier Part Number 1: CRCW0603169KFKEAHP-ND
R16 = RESISTOR_270K_1%_0603: RES 270k OHM 1% 1/10W 0603; Tolerance: +/- 1%; Made By: Andrew Lin; ComponentLink1Description: Datasheet; ComponentLink1URL: https://www.bourns.com/docs/product-datasheets/CRxxxxx.pdf; Wattage: 1/10W; Supplier: Digikey; Digikey Part Numer: CR0603-JW-104ELFTR-ND; Supplier 1: Mouser; Supplier Part Number 1: 71-CRCW0603-270K-E3
R17 R18 = PWR163S-25-10R0JE: RES SMD 10 OHM 5% 25W DPAK; Mfr_Name: Bourns Electronics; Copyright: Copyright (C) 2023 Ultra Librarian. All rights reserved.; Manufacturer_Part_Number: PWR163S-25-10R0JE; Supplier 1: Digi-Key; Supplier Part Number 1: 118-PWR163S-25-10R0JECT-ND
R21 R22 = CMP-33361-000001-1: 2W 0.010 OHMS 0.5% 2512; Manufacturer: Ohmite; Temperature Coefficient: 50ppm/°C; Resistance: 10mΩ; Automotive Grade: Grade 0; Tolerance: 0.%; Value: 10mΩ; ComponentLink2Description: Datasheet; Device Class L3: Chip SMD Resistors; Temperature Range Low: -55°C; Octopart: https://octopart.com/pcs2512dr0100et-ohmite-106082038; Power Rating: 2W; Composition: Metal Film; Temperature Range High: +170°C; Automotive: Yes; Manufacturer Part Number: PCS2512DR0100ET; Package: PCS2512; Series: PCS; Device Class L2: Resistors; Device Class L1: Passive Components; Lead Free: Yes; Category: Res; Height: 0.664mm; Ipc Land Pattern Name: RESC635305X41; RoHS: TRUE; Temperature: -55°C to +170°C; Digikey Description: 2W 0.010 OHMS 0.5% 2512; ComponentLink2URL: https://www.ohmite.com/assets/docs/res_pcs.pdf?r=false
R23 = CMP-2000-03206-1: Manufacturer: Vishay Dale; Part Number: CRCW06032R20FKEA
R24 R25 = RESISTOR_4.7_0603: RES 4.7 OHM 5% 1/8W 0603; Tolerance: +/- 5%; Made By: Robert Pafford; Wattage: 1/8W; Supplier: Digikey; Digikey Part Numer: CR0603-JW-104ELFTR-ND; Supplier 1: Digi-Key; Supplier Part Number 1: 2019-RK73B1JTTD4R7JCT-ND
R26 R27 = RESISTOR_27_0603: RES 27 OHM 5% 1/8W 0603; Tolerance: +/- 5%; Made By: Robert Pafford; ComponentLink1Description: Datasheet; ComponentLink1URL: https://www.bourns.com/docs/product-datasheets/CRxxxxx.pdf; Wattage: 1/8W; Supplier: Digikey; Digikey Part Numer: CR0603-JW-104ELFTR-ND; Supplier 1: Digi-Key; Supplier Part Number 1: 2019-RK73B1JTTD270JCT-ND
R28 R29 = RESISTOR_2.2K_0402_1: RES 2.2K OHM 1% 1/16W 0402; Tolerance: +/- 1%; Made By: Megan McCabe; Wattage: 1/16W; Supplier 1: Future Electronics; Supplier Part Number 1: 9737263
U1 = BQ25730RSNR: I2C 1 TO 5 CELL, 2-V, NARROW VDC, Charger IC Multi-Chemistry 32-QFN (4x4); Mfr_Name: Texas Instruments; Type: DEV; RefDes: RefDes; Copyright: Copyright (C) 2024 Ultra Librarian. All rights reserved.; Manufacturer_Part_Number: BQ25730RSNR; Supplier 1: Mouser; Supplier Part Number 1: 595-BQ25730RSNR
U2 = MAX98357AETE+T: Audio Amplifiers Digital Input Class D Amplifier; Mfr_Name: Analog Devices Inc; Made By: Andrew Lin; RefDes: RefDes; Supplier 1: Arrow Electronics; Supplier Part Number 1: MAX98357AETE+T
U3 = TS30041-M050QFNR: Buck Switching Regulator IC Positive Fixed 5V 1 Output 1A 16-VFQFN Exposed Pad; Made By: Robert Pafford; Output Voltage: 5V (Fixed); Max Input Voltage: 40V; Max Current: 1A; Supplier 1: Digi-Key; Supplier Part Number 1: TS30041-M050QFNRCT-ND
U4 = CMP-1109-00085-1: Low Drop Linear Voltage Regulator, 4.7 to 40 V Supply, 3.3 V Output, -40 to 150 degC, PG-SOT223 (SC-73), Reel, Green; Manufacturer: Infineon; Regulator Type: single output; Dropout Voltage: 250 mV; Green: TRUE; Max. Output Current: 400 mA; Typical Quiescent Current: 100 uA; Accuracy: 2 %; Output Voltage: 3.3 V; ComponentLink2URL: http://www.infineon.com/dgdl/TLE42744_DS_11.pdf?folderId=db3a304318f3fe290118f5a433570040&fileId=db3a304327b897500128012ccafe37d2&location=en.Products.Automotive_ICs.Linear_Voltage_Regulators_for_Automotive-Applications.Linear_Voltage_Regulators_-_Selectio; ComponentLink3URL: http://www.infineon.com/dgdl/SOT223-Package_Overview.pdf?folderId=db3a30431936bc4b0119530470b03c3d&fileId=db3a30431936bc4b0119531d40b93c5c; Operating Range: 4.7 to 40 V; PackageVersion: Apr-08; PartNumber: TLE42744GS V33; Packing: Reel; ComponentLink1URL: http://www.infineon.com/; ComponentLink2Description: Datasheet; DatasheetVersion: Rev. 1.1; ComponentLink3Description: Package Specification; PackageDescription: 4-Pin Small Outline Transistor Package, 6.5 x 3.5 mm Body, 2.3 mm Pitch; Mounting Technology: Surface Mount; PackageReference: PG-SOT223 (SC-73); ComponentLink1Description: Manufacturer URL
U5 = LTC4412ES6TRPBF: OR Controller Source Selector Switch P-Channel 2:1 TSOT-23-6; MP: LTC4412ES6#TRPBF; MF: Analog Devices; Price: None; Availability: Good; Mouser-Purchase-URL: https://snapeda.com/shop?store=Mouser&id=4343773; Arrow_Europe-Purchase-URL: https://snapeda.com/shop?store=Arrow+Europe&id=4343773; DigiKey-Purchase-URL: https://snapeda.com/shop?store=DigiKey&id=4343773; Package: SOT-23-6 Analog Devices; SnapEDA_Link: https://www.snapeda.com/parts/LTC4412ES6%23TRPBF/Analog%20Devices/view-part/4343773/?ref=snap; Value: *; Check_prices: https://www.snapeda.com/parts/LTC4412ES6%23TRPBF/Analog%20Devices/view-part/4343773/?ref=eda
U6-U9 = G30N03D3: N-Channel 30 V 30A 24W Surface Mount 8-DFN (3.15x3.05); Mfr_Name: Goford Semiconductor; VALUE_2: Value; Type: DEV; RefDes: RefDes; Copyright: Copyright (C) 2023 Ultra Librarian. All rights reserved.; Manufacturer_Part_Number: G30N03D3; Supplier 1: Digi-Key; Supplier Part Number 1: 3141-G30N03D3CT-ND